# Altium schematic sheet CPU.SCHDOC
size A3
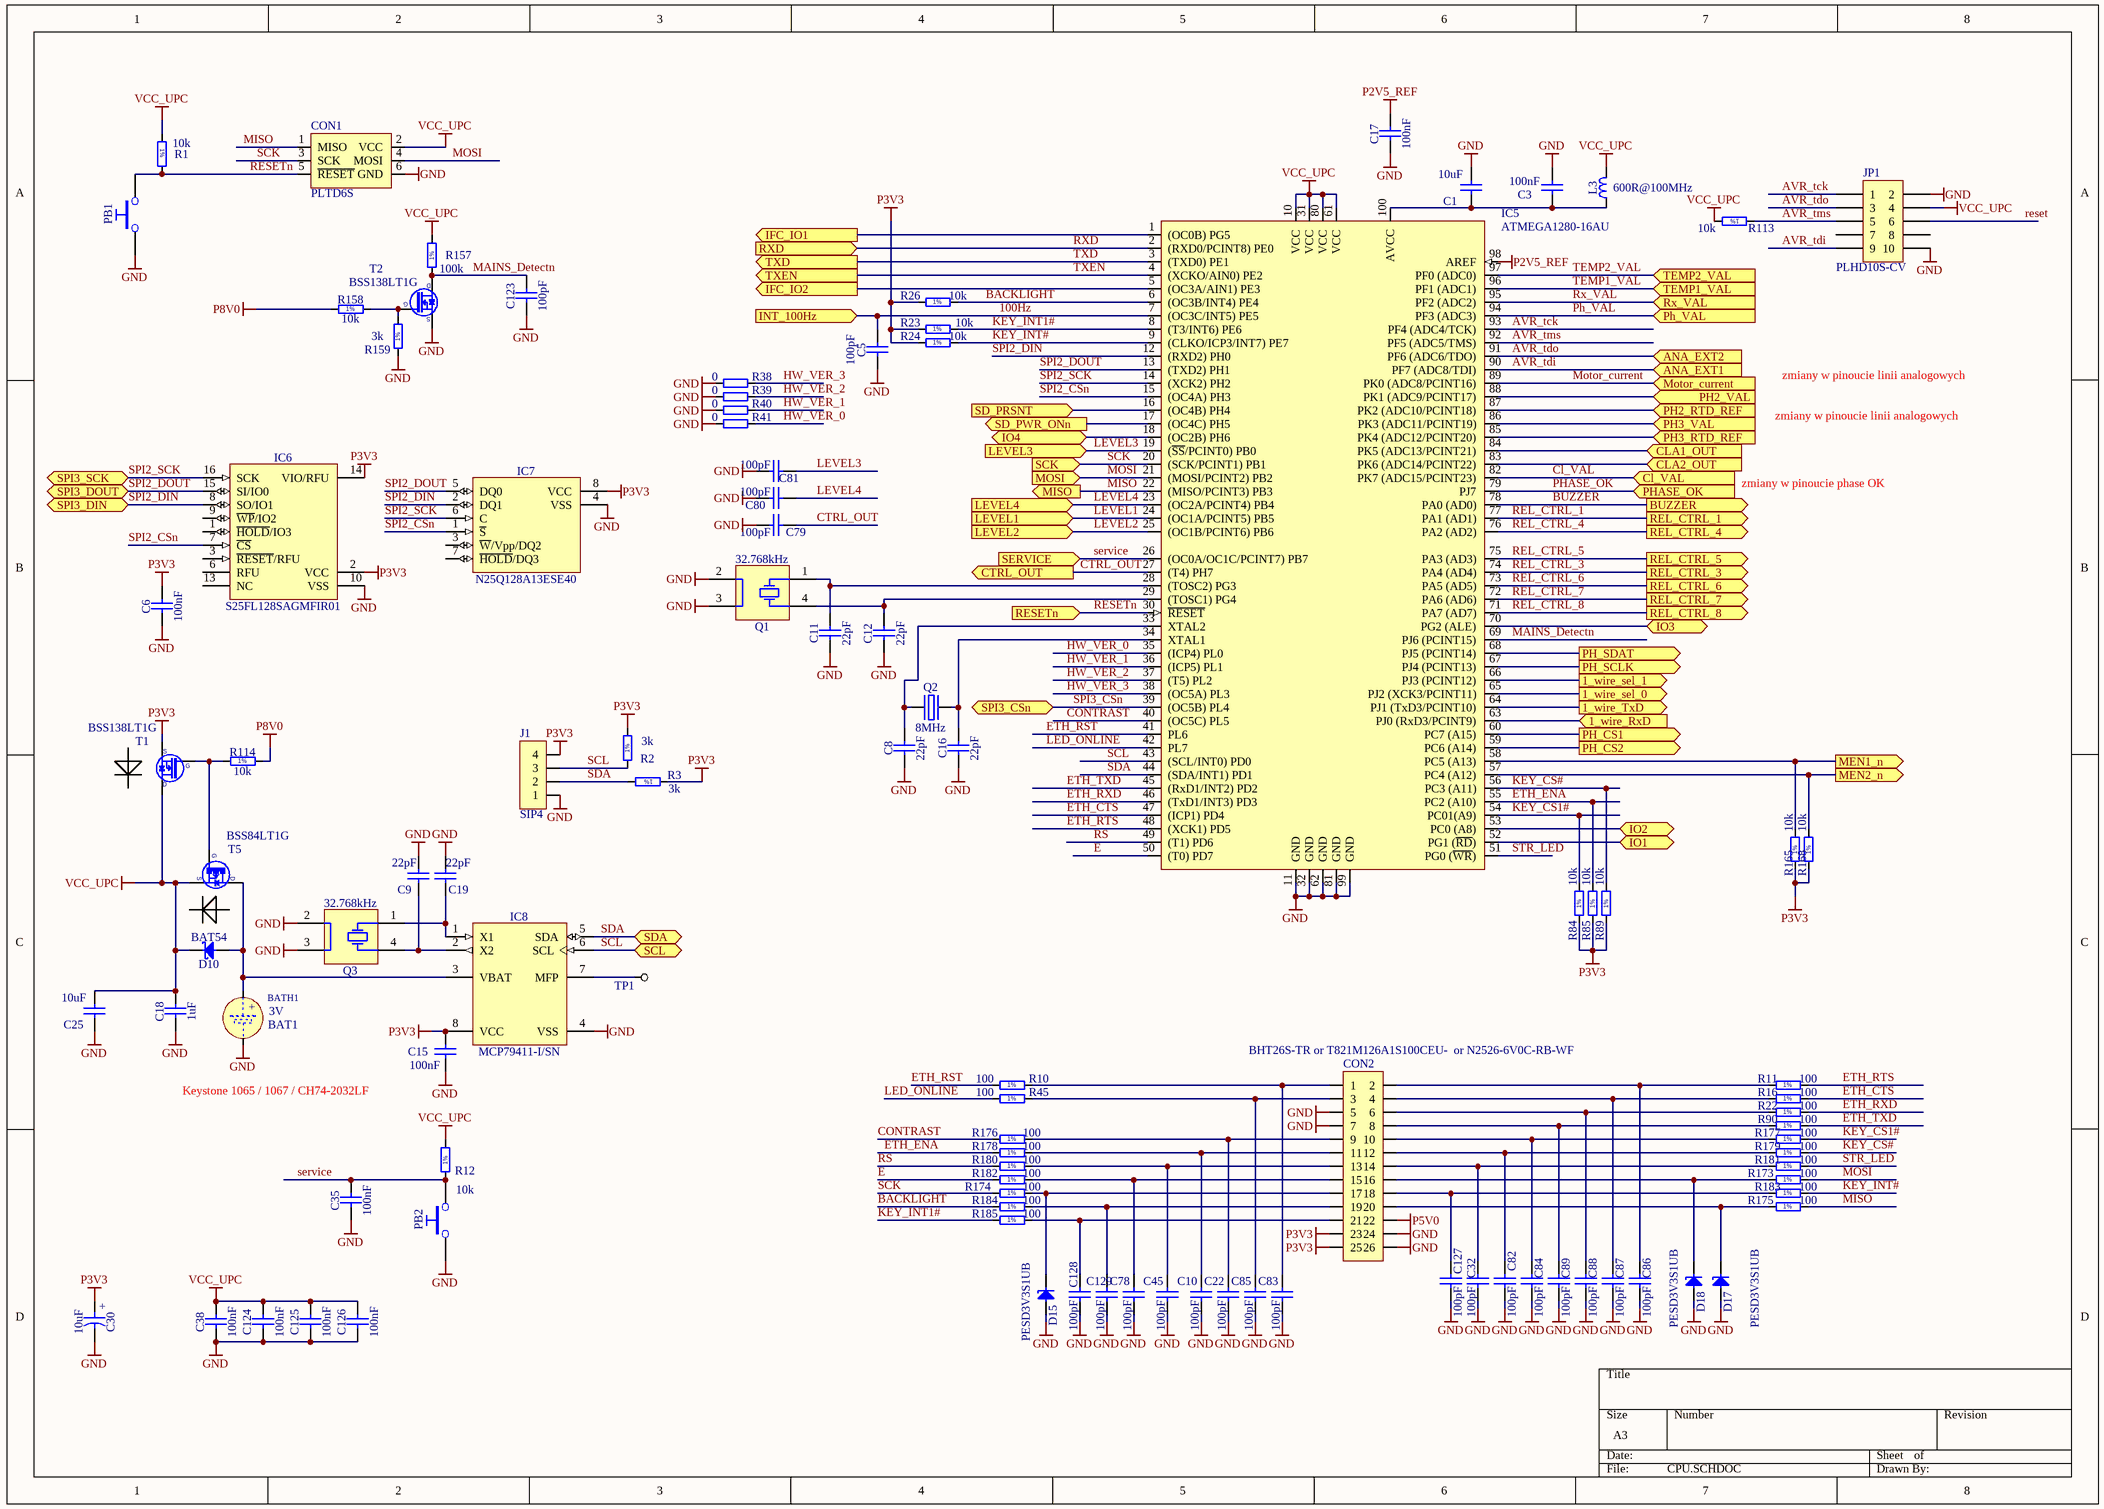
[diagram p0: CPU.SCHDOC]

## Parts
BAT1  3V  [BAT_VARTA_CR2032]
BATH1  (no value)  [BATH_KEYSTONE_1065_rev]
C1  10uF  [CAPC2012X135N]
C3  100nF  [CAPC1608X87N]
C5  100pF  [CAPC1608X87N]
C6  100nF  [CAPC1608X87N]
C8  22pF  [CAPC1608X87N]
C9  22pF  [CAPC1608X87N]
C10  100pF  [CAPC1608X87N]
C11  22pF  [CAPC1608X87N]
C12  22pF  [CAPC1608X87N]
C15  100nF  [CAPC1608X87N]
C16  22pF  [CAPC1608X87N]
C17  100nF  [CAPC1608X87N]
C18  1uF  [CAPC1608X87N]
C19  22pF  [CAPC1608X87N]
C22  100pF  [CAPC1608X87N]
C25  10uF  [CAPC2012X135N]
C30  10uF  [CAPAE430X540N]
C32  100pF  [CAPC1608X87N]
C35  100nF  [CAPC1608X87N]
C38  100nF  [CAPC1608X87N]
C45  100pF  [CAPC1608X87N]
C78  100pF  [CAPC1608X87N]
C79  100pF  [CAPC1608X87N]
C80  100pF  [CAPC1608X87N]
C81  100pF  [CAPC1608X87N]
C82  100pF  [CAPC1608X87N]
C83  100pF  [CAPC1608X87N]
C84  100pF  [CAPC1608X87N]
C85  100pF  [CAPC1608X87N]
C86  100pF  [CAPC1608X87N]
C87  100pF  [CAPC1608X87N]
C88  100pF  [CAPC1608X87N]
C89  100pF  [CAPC1608X87N]
C123  100pF  [CAPC1608X87N]
C124  100nF  [CAPC1608X87N]
C125  100nF  [CAPC1608X87N]
C126  100nF  [CAPC1608X87N]
C127  100pF  [CAPC1608X87N]
C128  100pF  [CAPC1608X87N]
C129  100pF  [CAPC1608X87N]
CON1  PLTD6S  [PLTD6S]
CON2  BHT26S-TR or T821M126A1S100CEU-  or N2526-6V0C-RB-WF  [BHT26S]
D10  BAT54  [SOT95P240X130-3N]
D15  PESD3V3S1UB  [SODFL1608X65N]
D17  PESD3V3S1UB  [SODFL1608X65N]
D18  PESD3V3S1UB  [SODFL1608X65N]
IC5  ATMEGA1280-16AU  [TQFP100]
IC6  S25FL128SAGMFIR01  [SOIC127P1030X265-16N]
IC7  N25Q128A13ESE40  [SOIC127P790X216-8N]
IC8  MCP79411-I/SN  [SOIC127P600X175-8N]
J1  SIP4  [SIP4]
JP1  PLHD10S-CV  [CON_2x5_MINI]
L3  600R@100MHz  [INDC1608X95N]
PB1  Push Button  [PB_TYCO_FSMSM]  (value not drawn)
PB2  Push Button  [PB_TYCO_FSMSM]  (value not drawn)
Q1  32.768kHz  [XTAL_ABRACON_ABS25]
Q2  8MHz  [XTAL_TXC_7A]
Q3  32.768kHz  [XTAL_ABRACON_ABS25]
R1  10k  [RESC1608X55N]
R2  3k  [RESC1608X55N]
R3  3k  [RESC1608X55N]
R10  100  [RESC1608X55N]
R11  100  [RESC1608X55N]
R12  10k  [RESC1608X55N]
R16  100  [RESC1608X55N]
R22  100  [RESC1608X55N]
R23  10k  [RESC1608X55N]
R24  10k  [RESC1608X55N]
R26  10k  [RESC1608X55N]
R38  0  [RESC1608X55N]
R39  0  [RESC1608X55N]
R40  0  [RESC1608X55N]
R41  0  [RESC1608X55N]
R45  100  [RESC1608X55N]
R84  10k  [RESC1608X55N]
R85  10k  [RESC1608X55N]
R89  10k  [RESC1608X55N]
R90  100  [RESC1608X55N]
R113  10k  [RESC1608X55N]
R114  10k  [RESC1608X55N]
R157  100k  [RESC1608X55N]
R158  10k  [RESC1608X55N]
R159  3k  [RESC1608X55N]
R165  10k  [RESC1608X55N]
R168  10k  [RESC1608X55N]
R173  100  [RESC1608X55N]
R174  100  [RESC1608X55N]
R175  100  [RESC1608X55N]
R176  100  [RESC1608X55N]
R177  100  [RESC1608X55N]
R178  100  [RESC1608X55N]
R179  100  [RESC1608X55N]
R180  100  [RESC1608X55N]
R181  100  [RESC1608X55N]
R182  100  [RESC1608X55N]
R183  100  [RESC1608X55N]
R184  100  [RESC1608X55N]
R185  100  [RESC1608X55N]
T1  BSS138LT1G  [SOT95P240X110-3N]
T2  BSS138LT1G  [SOT95P240X110-3N]
T5  BSS84LT1G  [SOT95P240X110-3N]
TP1  TP  [TP]  (value not drawn)

## Ports
1_wire_RxD (in), 1_wire_sel_0 (out), 1_wire_sel_1 (out), 1_wire_TxD (out), ANA_EXT1 (in), ANA_EXT2 (in), BUZZER (out), Cl_VAL (in), CLA1_OUT (in), CLA2_OUT (in), CTRL_OUT (out), IFC_IO1 (out), IFC_IO2 (out), INT_100Hz (in), IO1 (bidir), IO2 (bidir), IO3 (bidir), IO4 (bidir), LEVEL1 (in), LEVEL2 (in), LEVEL3 (in), LEVEL4 (in), MEN1_n (out), MEN2_n (out), MISO (out), MOSI (in), Motor_current (in), PH2_RTD_REF (in), PH2_VAL (in), PH3_RTD_REF (in), PH3_VAL (in), PH_CS1 (out), PH_CS2 (out), PH_SCLK (out), PH_SDAT (out), Ph_VAL (in), PHASE_OK (in), REL_CTRL_1 (out), REL_CTRL_3 (out), REL_CTRL_4 (out), REL_CTRL_5 (out), REL_CTRL_6 (out), REL_CTRL_7 (out), REL_CTRL_8 (out), RESETn (in), Rx_VAL (in), RXD (in), SCK (in), SCL (bidir), SD_PRSNT (in), SD_PWR_ONn (out), SDA (bidir), SERVICE (in), SPI3_CSn, SPI3_DIN, SPI3_DOUT, SPI3_SCK, TEMP1_VAL (in), TEMP2_VAL (in), TXD (out), TXEN (out)

## Nets
GND: BATH1.2(MINUS) C1.2 C3.2 C5.1 C6.1 C8.1 C9.2 C10.2 C11.1 C12.1 C15.2 C16.1 C17.1 C18.1 C19.2 C22.2 C25.1 C30.2 C32.1 C35.1 C38.1 C45.1 C78.1 C79.1 C80.1 C81.1 C82.1 C83.1 C84.1 C85.1 C86.1 C87.1 C88.1 C89.1 C123.1 C124.1 C125.1 C126.1 C127.1 C128.1 C129.1 CON1.6(GND) CON2.5 CON2.7 CON2.24 CON2.26 D15.2(A) D17.2(A) D18.2(A) IC5.11(GND) IC5.32(GND) IC5.62(GND) IC5.81(GND) IC5.99(GND) IC6.10(VSS) IC7.4(VSS) IC8.4(VSS) J1.1 JP1.2 JP1.10 PB1.1 PB2.1 Q1.2(GND) Q1.3(GND) Q3.2(GND) Q3.3(GND) R38.1 R39.1 R40.1 R41.1 R159.1 T2.2(S)
P2V5_REF: C17.2 IC5.98(AREF)
P3V3: C6.2 C15.1 C30.1 CON2.23 CON2.25 IC6.2(VCC) IC6.14(VIO/RFU) IC7.8(VCC) IC8.8(VCC) J1.4 R2.2 R3.1 R23.1 R24.1 R26.1 R84.1 R85.1 R89.1 R165.1 R168.1 T1.2(S)
P5V0: CON2.22
P8V0: R114.2 R158.1
VCC_UPC: C18.2 C25.2 C38.2 C124.2 C125.2 C126.2 CON1.2(VCC) D10.3(C) IC5.10(VCC) IC5.31(VCC) IC5.61(VCC) IC5.80(VCC) JP1.4 L3.2 R1.1 R12.2 R113.2 R157.2 T1.3(D) T5.2(S)
1_wire_RxD: IC5.63(PJ0_(RxD3/PCINT9)) ; port 1_wire_RxD
1_wire_sel_0: IC5.65(PJ2_(XCK3/PCINT11)) ; port 1_wire_sel_0
1_wire_sel_1: IC5.66(PJ3_(PCINT12)) ; port 1_wire_sel_1
1_wire_TxD: IC5.64(PJ1_(TxD3/PCINT10)) ; port 1_wire_TxD
100Hz: C5.2 IC5.7((OC3C/INT5)_PE5) ; port INT_100Hz
AVR_tck: IC5.93(PF4_(ADC4/TCK)) JP1.1
AVR_tdi: IC5.90(PF7_(ADC8/TDI)) JP1.9 ; port ANA_EXT1
AVR_tdo: IC5.91(PF6_(ADC6/TDO)) JP1.3 ; port ANA_EXT2
AVR_tms: IC5.92(PF5_(ADC5/TMS)) JP1.5 R113.1
BACKLIGHT: IC5.6((OC3B/INT4)_PE4) R26.2 R184.1
BUZZER: IC5.78(PA0_(AD0)) ; port BUZZER
Cl_VAL: IC5.82(PK7_(ADC15/PCINT23)) ; port Cl_VAL
CLA1_OUT: IC5.84(PK5_(ADC13/PCINT21)) ; port CLA1_OUT
CLA2_OUT: IC5.83(PK6_(ADC14/PCINT22)) ; port CLA2_OUT
CONTRAST: IC5.40((OC5C)_PL5) R176.1
CTRL_OUT: C79.2 IC5.27((T4)_PH7) ; port CTRL_OUT
E: IC5.50((T0)_PD7) R182.1
ETH_CTS: IC5.47((ICP1)_PD4) R16.2
ETH_ENA: IC5.55(PC2_(A10)) R85.2 R178.1
ETH_RST: IC5.41(PL6) R10.1
ETH_RTS: IC5.48((XCK1)_PD5) R11.2
ETH_RXD: IC5.46((TxD1/INT3)_PD3) R22.2
ETH_TXD: IC5.45((RxD1/INT2)_PD2) R90.2
HW_VER_0: IC5.35((ICP4)_PL0) R41.2
HW_VER_1: IC5.36((ICP5)_PL1) R40.2
HW_VER_2: IC5.37((T5)_PL2) R39.2
HW_VER_3: IC5.38((OC5A)_PL3) R38.2
IFC_IO1: IC5.1((OC0B)_PG5) ; port IFC_IO1
IFC_IO2: IC5.5((OC3A/AIN1)_PE3) ; port IFC_IO2
IO1: IC5.52(PG1_(~{RD})) ; port IO1
IO2: IC5.53(PC0_(A8)) ; port IO2
IO3: IC5.70(PG2_(ALE)) ; port IO3
IO4: IC5.18((OC2B)_PH6) ; port IO4
KEY_CS1#: IC5.54(PC01(A9)) R84.2 R177.2
KEY_CS#: IC5.56(PC3_(A11)) R89.2 R179.2
KEY_INT1#: IC5.8((T3/INT6)_PE6) R23.2 R185.1
KEY_INT#: IC5.9((CLKO/ICP3/INT7)_PE7) R24.2 R183.2
LED_ONLINE: IC5.42(PL7) R45.1
LEVEL1: IC5.24((OC1A/PCINT5)_PB5) ; port LEVEL1
LEVEL2: IC5.25((OC1B/PCINT6)_PB6) ; port LEVEL2
LEVEL3: C81.2 IC5.19((~{SS}/PCINT0)_PB0) ; port LEVEL3
LEVEL4: C80.2 IC5.23((OC2A/PCINT4)_PB4) ; port LEVEL4
MAINS_Detectn: C123.2 IC5.69(PJ6_(PCINT15)) R157.1 T2.3(D)
MEN1_n: IC5.58(PC5_(A13)) R165.2 ; port MEN1_n
MEN2_n: IC5.57(PC4_(A12)) R168.2 ; port MEN2_n
MISO: CON1.1(MISO) IC5.22((MISO/PCINT3)_PB3) R175.2 ; port MISO
MOSI: CON1.4(MOSI) IC5.21((MOSI/PCINT2)_PB2) R173.2 ; port MOSI
Motor_current: IC5.89(PK0_(ADC8/PCINT16)) ; port Motor_current
PH2_RTD_REF: IC5.87(PK2_(ADC10/PCINT18)) ; port PH2_RTD_REF
PH2_VAL: IC5.88(PK1_(ADC9/PCINT17)) ; port PH2_VAL
PH3_RTD_REF: IC5.85(PK4_(ADC12/PCINT20)) ; port PH3_RTD_REF
PH3_VAL: IC5.86(PK3_(ADC11/PCINT19)) ; port PH3_VAL
PH_CS1: IC5.60(PC7_(A15)) ; port PH_CS1
PH_CS2: IC5.59(PC6_(A14)) ; port PH_CS2
PH_SCLK: IC5.67(PJ4_(PCINT13)) ; port PH_SCLK
PH_SDAT: IC5.68(PJ5_(PCINT14)) ; port PH_SDAT
Ph_VAL: IC5.94(PF3_(ADC3)) ; port Ph_VAL
PHASE_OK: IC5.79(PJ7) ; port PHASE_OK
REL_CTRL_1: IC5.77(PA1_(AD1)) ; port REL_CTRL_1
REL_CTRL_3: IC5.74(PA4_(AD4)) ; port REL_CTRL_3
REL_CTRL_4: IC5.76(PA2_(AD2)) ; port REL_CTRL_4
REL_CTRL_5: IC5.75(PA3_(AD3)) ; port REL_CTRL_5
REL_CTRL_6: IC5.73(PA5_(AD5)) ; port REL_CTRL_6
REL_CTRL_7: IC5.72(PA6_(AD6)) ; port REL_CTRL_7
REL_CTRL_8: IC5.71(PA7_(AD7)) ; port REL_CTRL_8
reset: JP1.6
RESETn: CON1.5(~{RESET}) IC5.30(~{RESET}) PB1.2 R1.2 ; port RESETn
RS: IC5.49((T1)_PD6) R180.1
Rx_VAL: IC5.95(PF2_(ADC2)) ; port Rx_VAL
RXD: IC5.2((RXD0/PCINT8)_PE0) ; port RXD
SCK: CON1.3(SCK) IC5.20((SCK/PCINT1)_PB1) R174.1 ; port SCK
SCL: IC5.43((SCL/INT0)_PD0) IC8.6(SCL) J1.3 R2.1 ; port SCL
SD_PRSNT: IC5.16((OC4B)_PH4) ; port SD_PRSNT
SD_PWR_ONn: IC5.17((OC4C)_PH5) ; port SD_PWR_ONn
SDA: IC5.44((SDA/INT1)_PD1) IC8.5(SDA) J1.2 R3.2 ; port SDA
service: C35.2 IC5.26((OC0A/OC1C/PCINT7)_PB7) PB2.2 R12.1 ; port SERVICE
SPI2_CSn: IC5.15((OC4A)_PH3) IC6.7(~{CS}) IC7.1(~{S})
SPI2_DIN: IC5.12((RXD2)_PH0) IC6.8(SO/IO1) IC7.2(DQ1) ; port SPI3_DIN
SPI2_DOUT: IC5.13((TXD2)_PH1) IC6.15(SI/IO0) IC7.5(DQ0) ; port SPI3_DOUT
SPI2_SCK: IC5.14((XCK2)_PH2) IC6.16(SCK) IC7.6(C) ; port SPI3_SCK
SPI3_CSn: IC5.39((OC5B)_PL4) ; port SPI3_CSn
STR_LED: IC5.51(PG0_(~{WR})) R181.2
TEMP1_VAL: IC5.96(PF1_(ADC1)) ; port TEMP1_VAL
TEMP2_VAL: IC5.97(PF0_(ADC0)) ; port TEMP2_VAL
TXD: IC5.3((TXD0)_PE1) ; port TXD
TXEN: IC5.4((XCKO/AIN0)_PE2) ; port TXEN
NetBATH1_1: BATH1.1(PLUS) D10.1(A) IC8.3(VBAT) T5.3(D)
NetC1_1: C1.1 C3.1 IC5.100(AVCC) L3.1
NetC8_2: C8.2 IC5.33(XTAL2) Q2.1(OSC1)
NetC9_1: C9.1 IC8.2(X2) Q3.4(X)
NetC10_1: C10.1 CON2.11 R178.2
NetC11_2: C11.2 IC5.28((TOSC2)_PG3) Q1.1(X)
NetC12_2: C12.2 IC5.29((TOSC1)_PG4) Q1.4(X)
NetC16_2: C16.2 IC5.34(XTAL1) Q2.2(OSC2)
NetC19_1: C19.1 IC8.1(X1) Q3.1(X)
NetC22_1: C22.1 CON2.9 R176.2
NetC32_2: C32.2 CON2.14 R181.1
NetC45_2: C45.2 CON2.13 R180.2
NetC78_2: C78.2 CON2.15 R182.2
NetC82_2: C82.2 CON2.12 R179.1
NetC83_2: C83.2 CON2.1 R10.2
NetC84_2: C84.2 CON2.10 R177.1
NetC85_2: C85.2 CON2.3 R45.2
NetC86_2: C86.2 CON2.2 R11.1
NetC87_2: C87.2 CON2.4 R16.1
NetC88_2: C88.2 CON2.6 R22.1
NetC89_2: C89.2 CON2.8 R90.1
NetC127_2: C127.2 CON2.18 R183.1
NetC128_2: C128.2 CON2.21 R185.2
NetC129_2: C129.2 CON2.19 R184.2
NetCON2_16: CON2.16 D18.1(C) R173.1
NetCON2_17: CON2.17 D15.1(C) R174.2
NetCON2_20: CON2.20 D17.1(C) R175.1
NetIC8_7: IC8.7(MFP) TP1.1
NetR114_1: R114.1 T1.1(G) T5.1(G)
NetR158_2: R158.2 R159.2 T2.1(G)

Not connected (* = marked no-connect by the designer): IC6 1(~{HOLD}/IO3) 3(~{RESET}/RFU) 6(RFU) 9(~{WP}/IO2) 13(NC); IC7 3(~{W}/Vpp/DQ2) 7(~{HOLD}/DQ3); JP1 7 8

## Notes on the sheet
- zmiany w pinoucie linii analogowych
- zmiany w pinoucie phase OK
- Keystone 1065 / 1067 / CH74-2032LF
- (in symbol BAT_VARTA_CR2032) +
- (in symbol BATTERY_HOLD_2012) +
- (in symbol CAE430-540_10UF_25V_20%) +
- (in symbol R0603_3K_1%_0.1W_100PPM) 1%
- (in symbol R0603_10K_1%_0.1W_100PPM) 1%
- (in symbol R0603_100K_1%_0.1W_100PPM) 1%
- (in symbol R0603_100R_1%_0.1W_100PPM) 1%

## Library data of the parts
BAT1 = BAT_VARTA_CR2032: Battery for use only with Socket Holder; Part Description: 20x3.2mm Lithium Coin Cells Type CR2032; Manufacturer: VARTA; Manufacturer Part Number: 6032101501; PressFit: No; Power: 230mAh; Part Number: BAT_VARTA_CR2032; Component Kind: Standard; Component Type: Standard; Pin Count: 0; PackageDescription: CR2032, 20mm Diameter x 3.2mm  Height Lithium Coin Cells; Family: Battery; Mounted: Yes; Socket: Yes; SMD: No; Sense: No; Value: 3V; ComponentHeight: 3.2mm; HelpURL: \\cern.ch\dfs\Applications\Altium\Datasheets\BAT_VARTA_CR2032.pdf; Author: CERN DEM JLC; CreateDate: 2009-10-20; LatestRevisionDate: 2009-10-20
BATH1 = BATTERY_HOLD_2012: Battery Holder whit 2 Pin; Part Number: BATH_KEYSTONE_1065; Part Description: SMD Battery Holders for BR2012,CR2012,BR2016, CR2016, DL2016, BR2020, CL2020, BR2025, CR2025, DL2025, BR2032, CR2032, DL2032, ANSI 5000LC, IEC CR2016 Coin Cells; Manufacturer: KEYSTONE; Manufacturer Part Number: 1065; PressFit: No; Component Kind: Standard; Component Type: Standard; Footprint: BATH_KEYSTONE_1065; Pin Count: 2; PackageDescription: SMD Battery Holders for BR2012,CR2012,BR2016, CR2016, DL2016, BR2020, CL2020, BR2025, CR2025, DL2025, BR2032, CR2032, DL2032, ANSI 5000LC, IEC CR2016 Coin Cells; Family: Battery; Mounted: Yes; Socket: No; SMD: No; Sense: No; ComponentHeight: 25.4mm; HelpURL: \\cern.ch\dfs\Applications\Altium\Datasheets\BATH_KEYSTONE_1065.pdf; Author: CERN DEM MR; CreateDate: 2016-03-14; LatestRevisionDate: 2016-03-14
C1 C25 = CC0805_10UF_16V_10%_X5R: Non-polarised capacitor; Part Description: SMD Multilayer Chip Ceramic Capacitor; Manufacturer: GENERIC; Manufacturer1 Part Number: C0805C106K4PAC; Voltage: 16V; TC: X5R; Tolerance: ±10%; Part Number: CC0805_10UF_16V_10%_X5R; Component Kind: Standard; Component Type: Standard; Pin Count: 2; Value: 10uF; Status: Preferred; Manufacturer Part Number: CC0805_10UF_16V_10%_X5R; Case: 0805; Mounted: Yes; Socket: No; SMD: Yes; Sense: No; Manufacturer1 Example: KEMET; Manufacturer1 ComponentHeight: 1.4mm; HelpURL: \\cern.ch\dfs\Applications\Altium\Datasheets\CC1206_X5R_KEMET.pdf; Author: CERN DEM JLC; CreateDate: 2007-12-03; LatestRevisionDate: 2007-12-03
C3 C6 C15 C17 C35 C38 C124-C126 = CC0603_100NF_50V_10%_X7R: Non-polarised capacitor; Part Description: SMD Multilayer Chip Ceramic Capacitor; Manufacturer: GENERIC; Manufacturer1 Part Number: 223858615649; Voltage: 50V; TC: X7R; Tolerance: ±10%; Part Number: CC0603_100NF_50V_10%_X7R; Component Kind: Standard; Component Type: Standard; Pin Count: 2; Value: 100nF; Status: Preferred; Manufacturer Part Number: CC0603_100NF_50V_10%_X7R; Case: 0603; Mounted: Yes; Socket: No; SMD: Yes; Sense: No; Manufacturer1 Example: PHYCOMP; Manufacturer1 ComponentHeight: 0.87mm; HelpURL: \\cern.ch\dfs\Applications\Altium\Datasheets\CC0603_X7R_PHYCOMP.pdf; Author: CERN DEM JLC; CreateDate: 2007-12-03; LatestRevisionDate: 2007-12-03
C5 C10 C22 C32 C45 C78-C89 C123 C127-C129 = CC0603_100PF_50V_10%_X7R: Non-polarised capacitor; Part Description: SMD Multilayer Chip Ceramic Capacitor; Manufacturer: GENERIC; Manufacturer1 Part Number: 223858615609; Voltage: 50V; TC: X7R; Tolerance: ±10%; Part Number: CC0603_100PF_50V_10%_X7R; Component Kind: Standard; Component Type: Standard; Pin Count: 2; Value: 100pF; Status: Preferred; Manufacturer Part Number: CC0603_100PF_50V_10%_X7R; Case: 0603; Mounted: Yes; Socket: No; SMD: Yes; Sense: No; Manufacturer1 Example: PHYCOMP; Manufacturer1 ComponentHeight: 0.9mm; HelpURL: \\cern.ch\dfs\Applications\Altium\Datasheets\CC0603_X7R_PHYCOMP.pdf; Author: CERN DEM JLC; CreateDate: 2012-08-15; LatestRevisionDate: 2012-08-15
C8 C9 C11 C12 C16 C19 = CC0603_22PF_50V_5%_NP0: Non-polarised capacitor; Part Description: SMD Multilayer Chip Ceramic Capacitor; Manufacturer: GENERIC; Manufacturer1 Part Number: 223886715229; Voltage: 50V; TC: C0G/NP0; Tolerance: ±5%; Part Number: CC0603_22PF_50V_5%_NP0; Component Kind: Standard; Component Type: Standard; Pin Count: 2; Value: 22pF; Status: Preferred; Manufacturer Part Number: CC0603_22PF_50V_5%_NP0; Case: 0603; Mounted: Yes; Socket: No; SMD: Yes; Sense: No; Manufacturer1 Example: PHYCOMP; Manufacturer1 ComponentHeight: 0.87mm; HelpURL: \\cern.ch\dfs\Applications\Altium\Datasheets\CC0603_NP0_PHYCOMP.pdf; Author: CERN DEM JLC; CreateDate: 2007-12-03; LatestRevisionDate: 2007-12-03
C18 = CC0603_1UF_25V_10%_X7R: Non-polarised capacitor; Part Description: SMD Multilayer Chip Ceramic Capacitor; Manufacturer: GENERIC; Manufacturer1 Part Number: GRM188R71E105KA12D; Voltage: 25V; TC: X7R; Tolerance: ±10%; Part Number: CC0603_1UF_25V_10%_X7R; Component Kind: Standard; Component Type: Standard; Pin Count: 2; Value: 1uF; Status: None; Manufacturer Part Number: CC0603_1UF_25V_10%_X7R; Case: 0603; Mounted: Yes; Socket: No; SMD: Yes; Sense: No; Manufacturer1 Example: MURATA; Manufacturer1 ComponentHeight: 0.9mm; HelpURL: \\cern.ch\dfs\Applications\Altium\Datasheets\CC0603_X7R_MURATA.pdf; Author: CERN DEM JLC; CreateDate: 2011-01-18; LatestRevisionDate: 2011-01-18
C30 = CAE430-540_10UF_25V_20%: Polarised capacitor; Part Description: Aluminum Electrolytic SMT Capacitor; Manufacturer: PANASONIC; Manufacturer Part Number: EEEFK1E100AR; Voltage: 25V; Tolerance: ±20%; Part Number: CAE430-540_10UF_25V_20%; Component Kind: Standard; Component Type: Standard; Pin Count: 2; Value: 10uF; Status: Not Recommended; Case: B; Mounted: Yes; Socket: No; SMD: Yes; Sense: No; ComponentHeight: 5.8mm; HelpURL: \\cern.ch\dfs\Applications\Altium\Datasheets\CAE_PANASONIC_FK.pdf; Author: CERN DEM JLC; CreateDate: 2007-12-03; LatestRevisionDate: 2014-11-05
CON1 = CON_ISP: 6x 2.54mm SMT  dual row pin header
CON2 = CON_IDC26_SMT: Maritex BHT 26S, 3M N2526-6V0C-RB-WF, Amphenol T821M126A1S100CEU
D10 = BAT54: Diode Schottky  Anode Pin 1 Cathode Pin 3 (Pas de pin 2); Part Description: Single Small Signal Schottky Diode; Manufacturer: FAIRCHILD SEMICONDUCTOR; Voltage: 30V; Power: 200mA; PressFit: No; Bonding: No; Part Number: BAT54; Component Kind: Standard; Component Type: Standard; Device: BAT54; PackageDescription: SOT23 3-Leads, Pitch 0.95mm - Body 1.3x2.9mm, IPC Medium Density; Manufacturer Part Number: BAT54; Pin Count: 3; Case: SOT23-3; Mounted: Yes; Socket: No; SMD: Yes; Sense: No; ComponentHeight: 1.30mm; HelpURL: \\cern.ch\dfs\Applications\Altium\Datasheets\BAT54.pdf; Author: CERN DEM JLC; CreateDate: 2009-09-17; LatestRevisionDate: 2010-05-27
D15 D17 D18 = PESD3V3S1UB: ESD protection diode; Part Description: ESD protection diode (23kV); Manufacturer: NXP SEMICONDUCTORS; Voltage: 3V3; Power: 330W; PressFit: No; Bonding: No; Part Number: PESD3V3S1UB; Component Kind: Standard; Component Type: Standard; Device: PESD3V3S1UB; PackageDescription: Ultra Small Outline Diode Flat Lead (SOD-523), Body; 1.2mm L X 0.8mm W X 0.65mm H, IPC Medium Density; Manufacturer Part Number: PESD3V3S1UB; Pin Count: 2; Case: SOD523; Mounted: Yes; Socket: No; SMD: Yes; Sense: No; ComponentHeight: 0.65mm; HelpURL: \\cern.ch\dfs\Applications\Altium\Datasheets\PESD3V3S1UB.pdf; Author: CERN DEM JLC; CreateDate: 2012-11-29; LatestRevisionDate: 2012-11-29
IC5 = UPC_ATMEGA1280: 8MHz, 8 bit AVR microcontroller
IC6 = S25FL128SAGMFIR01: 128Mbit, MirrorBit® Flash Non-Volatile Memory CMOS 3.0 Volt Core with Versatile I/O Serial Peripheral Interface with Multi-I/O; Part Description: 128Mbit, 133MHz, MirrorBit® Flash Non-Volatile Memory CMOS 3V Core with Versatile I/O Serial Peripheral Interface with Multi-I/O; Manufacturer: SPANSION; PressFit: No; Bonding: No; Part Number: S25FL128SAGMFIR01; Component Kind: Standard; Component Type: Standard; Device: S25FL128SAGMFIR01; PackageDescription: SOIC 16, Pitch 1.27mm - Body 7.5x10.3mm, IPC Medium Density; Manufacturer Part Number: S25FL128SAGMFIR01; Pin Count: 11; Case: SOIC16; Mounted: Yes; Socket: No; SMD: Yes; Sense: No; ComponentHeight: 2.65mm; HelpURL: \\cern.ch\dfs\Applications\Altium\Datasheets\S25FL128SAGMFIR01.pdf; Author: CERN DEM JLC; CreateDate: 2014-07-10; LatestRevisionDate: 2014-07-10
IC7 = N25Q128A13ESE40: 128Mb, 3V, Multiple I/O Serial NOR Flash Memory; Part Description: 128Mb, 2.7 to 3.6V, Multiple I/O Serial NOR Flash Memory; Manufacturer: MICRON TECHNOLOGY; PressFit: No; Bonding: No; Part Number: N25Q128A13ESE40; Component Kind: Standard; Component Type: Standard; Device: N25Q128A13ESE40; PackageDescription: SOIC, 1.27mm Pitch; 8 Pin, 5.285mm W X 5.335mm L X 2.16mm H body, IPC Medium Density; Manufacturer Part Number: N25Q128A13ESE40; Pin Count: 8; Case: SOIC8; Mounted: Yes; Socket: No; SMD: Yes; Sense: No; ComponentHeight: 2.16mm; HelpURL: \\cern.ch\dfs\Applications\Altium\Datasheets\N25Q128A13ESE40.pdf; Author: CERN DEM JLC; CreateDate: 2011-11-28; LatestRevisionDate: 2015-07-30
IC8 = RTC_MCP79411: I2C Real-Time Clock/Calendar with EEPROM, SRAM, Unique ID and Battery Switchover; Manufacturer: MICROCHIP TECHNOLOGY; PressFit: No; Bonding: No; Part Number: MCP79411-I/SN; Component Kind: Standard; Component Type: Standard; Device: MCP79411-I/SN; PackageDescription: SOIC 8, Pitch 1.27mm - Body 3.9x4.9mm, IPC Medium Density; Part Description: I2C Real-Time Clock/Calendar with EEPROM, SRAM, Unique ID and Battery Switchover; Manufacturer Part Number: MCP79411-I/SN; Pin Count: 8; Case: SOIC8; Mounted: Yes; Socket: No; SMD: Yes; Sense: No; ComponentHeight: 1.75mm; HelpURL: \\cern.ch\dfs\Applications\Altium\Datasheets\MCP79410-I-SN.pdf; Author: GK; CreateDate: 2015-07-10; LatestRevisionDate: 2015-07-10
J1 = CON4: Connector
JP1 = CON_2x5 1.27 male: Goldpin 1.27mm
L3 = IND0603_MURATA_BLM18BD601SN1D: Inductor; Part Description: SMD EMIFIL Suppression Chip Ferrite Bead; Manufacturer: MURATA; Power: 200mA; Resistance: 0.65R; Tolerance: ±25%; Part Number: IND0603_MURATA_BLM18BD601SN1D; Component Kind: Standard; Component Type: Standard; Pin Count: 2; Value: 600R@100MHz; Status: None; Manufacturer Part Number: BLM18BD601SN1D; Case: 0603; Mounted: Yes; Socket: No; SMD: Yes; Sense: No; ComponentHeight: 0.95mm; HelpURL: \\cern.ch\dfs\Applications\Altium\Datasheets\IND0603_MURATA_BLM18B.pdf; Author: CERN DEM JLC; CreateDate: 2012-07-04; LatestRevisionDate: 2013-12-09
PB1 PB2 = PB_TYCO_FSMSM: Push-Button Switch SPDT; Part Description: 12VDC 50mA SPST Tactile  Push-Button Switch; Manufacturer: TYCO ELECTRONICS; Manufacturer Part Number: FSMSM or 1437566-3; PressFit: No; Part Number: PB_TYCO_FSMSM; Component Kind: Standard; Component Type: Standard; Pin Count: 2; PackageDescription: Body 3.5x6.0mm, Pushbutton Switch,  TYCO ALCOSWITCH FSMSM Serie; Family: Push Button; Mounted: Yes; Socket: No; SMD: Yes; Sense: No; Status: None; ComponentHeight: 4.3mm; HelpURL: \\cern.ch\dfs\Applications\Altium\Datasheets\PB_TYCO_FSMSM.pdf; Author: CERN DEM JLC; CreateDate: 2008-06-30; LatestRevisionDate: 2012-06-21
Q1 Q3 = XTAL_32.768KHZ_ABRACON_ABS25-32.768KHZ-T: Crystal 4 pins 1=XTAL Control 2 And 3=NC 4=XTAL; Part Description: Tolerance: ±20ppm, -40°C to +85°C, 12.5pF, SMD Crystal, ABS25 Series; PressFit: No; Bonding: No; Part Number: XTAL_32.768KHZ_ABRACON_ABS25-32.768KHZ-T; Component Kind: Standard; Component Type: Standard; PackageDescription: 4 Pins, 8mm L X 3.8mm W X 2.7mm H, SMD Crystal, ABS25 Serie; Value: 32.768kHz; Manufacturer: ABRACON; Manufacturer Part Number: ABS25-32.768KHZ-T; Pin Count: 4; Mounted: Yes; Socket: No; SMD: Yes; Sense: No; ComponentHeight: 2.7mm; HelpURL: \\cern.ch\dfs\Applications\Altium\Datasheets\XTAL_ABRACON_ABS25.pdf; Author: CERN DEM JMW; CreateDate: 2015-07-15; LatestRevisionDate: 2015-07-15
Q2 = XTAL_8MHZ_TXC_7A-8.000MAAE-T: Quartz Crystal; Part Description: Tolerance: ±30ppm, Stability: ±30ppm, -20°C to +70°C, 12pF, SMD Glass Seam Sealing Crystal, 7A Series; Manufacturer: TXC CORPORATION; PressFit: No; Bonding: No; Part Number: XTAL_8MHZ_TXC_7A-8.000MAAE-T; Component Kind: Standard; Component Type: Standard; PackageDescription: 2 Pins, 3.2x5mm, SMD Glass Seam Sealing Crystal, 7A Serie; Value: 8MHz; Manufacturer Part Number: 7A-8.000MAAE-T; Pin Count: 2; Mounted: Yes; Socket: No; SMD: Yes; Sense: No; ComponentHeight: 1.2mm; HelpURL: \\cern.ch\dfs\Applications\Altium\Datasheets\XTAL_TXC_7A.pdf; Author: CERN DEM JLC; CreateDate: 2014-10-09; LatestRevisionDate: 2014-11-12
R1 R12 R23 R24 R26 R84 R85 R89 R113 R114 R158 R165 R168 = R0603_10K_1%_0.1W_100PPM: Resistor - 1%; Part Description: General Purpose Thick Film Chip Resistor; Manufacturer: GENERIC; Manufacturer1 Part Number: NRC06F1002TRF; Power: 0.1W; TC: ±100ppm/°C; Part Number: R0603_10K_1%_0.1W_100PPM; Component Kind: Standard; Component Type: Standard; Pin Count: 2; Value: 10k; Status: Preferred; Tolerance: ±1%; Manufacturer Part Number: R0603_10K_1%_0.1W_100PPM; Case: 0603; Mounted: Yes; Sense: No; Socket: No; SMD: Yes; Manufacturer1 Example: NIC COMPONENT; Manufacturer1 ComponentHeight: 0.55mm; HelpURL: \\cern.ch\dfs\Applications\Altium\Datasheets\R0603_NIC_NRC.pdf; Author: CERN DEM JLC; CreateDate: 2007-12-03; LatestRevisionDate: 2008-03-13
R2 R3 R159 = R0603_3K_1%_0.1W_100PPM: Resistor - 1%; Part Description: General Purpose Thick Film Chip Resistor; Manufacturer: GENERIC; Manufacturer1 Part Number: NRC06F3001TRF; Power: 0.1W; TC: ±100ppm/°C; Part Number: R0603_3K_1%_0.1W_100PPM; Component Kind: Standard; Component Type: Standard; Pin Count: 2; Value: 3k; Status: Preferred; Tolerance: ±1%; Manufacturer Part Number: R0603_3K_1%_0.1W_100PPM; Case: 0603; Mounted: Yes; Sense: No; Socket: No; SMD: Yes; Manufacturer1 Example: NIC COMPONENT; Manufacturer1 ComponentHeight: 0.55mm; HelpURL: \\cern.ch\dfs\Applications\Altium\Datasheets\R0603_NIC_NRC.pdf; Author: CERN DEM JLC; CreateDate: 2007-12-03; LatestRevisionDate: 2008-03-13
R10 R11 R16 R22 R45 R90 R173-R185 = R0603_100R_1%_0.1W_100PPM: Resistor - 1%; Part Description: General Purpose Thick Film Chip Resistor; Manufacturer: GENERIC; Manufacturer1 Part Number: NRC06F4700TRF; Power: 0.1W; TC: ±100ppm/°C; Part Number: R0603_100R_1%_0.1W_100PPM; Component Kind: Standard; Component Type: Standard; Pin Count: 2; Value: 100; Status: Preferred; Tolerance: ±1%; Manufacturer Part Number: R0603_100R_1%_0.1W_100PPM; Case: 0603; Mounted: Yes; Sense: No; Socket: No; SMD: Yes; Manufacturer1 Example: NIC COMPONENT; Manufacturer1 ComponentHeight: 0.55mm; HelpURL: \\cern.ch\dfs\Applications\Altium\Datasheets\R0603_NIC_NRC.pdf; Author: CERN DEM JLC; CreateDate: 2007-12-03; LatestRevisionDate: 2008-03-13
R38-R41 = R0603_0R_JUMPER: Resistor; Part Description: 1A (0.05R Max DC Resistance) Zero Ohm Jumper; Manufacturer: GENERIC; Manufacturer1 Part Number: NRC06Z0; Part Number: R0603_0R_JUMPER; Component Kind: Standard; Component Type: Standard; Pin Count: 2; Value: 0; Status: Preferred; Manufacturer Part Number: R0603_0R_JUMPER; Case: 0603; Mounted: Yes; Sense: No; Socket: No; SMD: Yes; Manufacturer1 Example: NIC COMPONENT; Manufacturer1 ComponentHeight: 0.55mm; HelpURL: \\cern.ch\dfs\Applications\Altium\Datasheets\R0603_NIC_NRC.pdf; Author: CERN DEM JLC; CreateDate: 2007-12-03; LatestRevisionDate: 2008-03-13
R157 = R0603_100K_1%_0.1W_100PPM: Resistor - 1%; Part Description: General Purpose Thick Film Chip Resistor; Manufacturer: GENERIC; Manufacturer1 Part Number: NRC06F1003TRF; Power: 0.1W; TC: ±100ppm/°C; Part Number: R0603_100K_1%_0.1W_100PPM; Component Kind: Standard; Component Type: Standard; Pin Count: 2; Value: 100k; Status: Preferred; Tolerance: ±1%; Manufacturer Part Number: R0603_100K_1%_0.1W_100PPM; Case: 0603; Mounted: Yes; Sense: No; Socket: No; SMD: Yes; Manufacturer1 Example: NIC COMPONENT; Manufacturer1 ComponentHeight: 0.55mm; HelpURL: \\cern.ch\dfs\Applications\Altium\Datasheets\R0603_NIC_NRC.pdf; Author: CERN DEM JLC; CreateDate: 2007-12-03; LatestRevisionDate: 2008-03-13
T1 T2 = BSS138LT1G: N-CHANNEL MOSFET WITH DIODE; Part Description: 50V 200mA N-Channel Enhancement Mode Field-Effect Transistor; Manufacturer: ON SEMICONDUCTOR; PressFit: No; Bonding: No; Part Number: BSS138LT1G; Component Kind: Standard; Component Type: Standard; Device: BSS138LT1G; PackageDescription: SOT23 3-Leads, Pitch 0.95mm - Body 1.4x3mm, IPC Medium Density; Manufacturer Part Number: BSS138LT1G; Pin Count: 3; Case: SOT23-3; Mounted: Yes; Socket: No; SMD: Yes; Sense: No; ComponentHeight: 1.11mm; HelpURL: \\cern.ch\dfs\Applications\Altium\Datasheets\BSS138LT1G.pdf; Author: CERN DEM JLC; CreateDate: 2009-03-23; LatestRevisionDate: 2009-03-23
T5 = BSS84LT1G: P-CHANNEL MOSFET WITH DIODE; Part Description: 50V 130mA Single P-Channel Power MOSFET; Manufacturer: ON SEMICONDUCTOR; PressFit: No; Bonding: No; Part Number: BSS84LT1G; Component Kind: Standard; Component Type: Standard; Device: BSS84LT1G; PackageDescription: SOT23 3-Leads, Pitch 0.95mm - Body 1.4x3mm, IPC Medium Density; Manufacturer Part Number: BSS84LT1G; Pin Count: 3; Case: SOT23-3; Mounted: Yes; Socket: No; SMD: Yes; Sense: No; ComponentHeight: 1.1mm; HelpURL: \\cern.ch\dfs\Applications\Altium\Datasheets\BSS84LT1G.pdf; Author: CERN DEM JLC; CreateDate: 2012-03-29; LatestRevisionDate: 2012-03-29
TP1 = TP: Testpoint